# Altium schematic sheet schematic.SchDoc
size A3
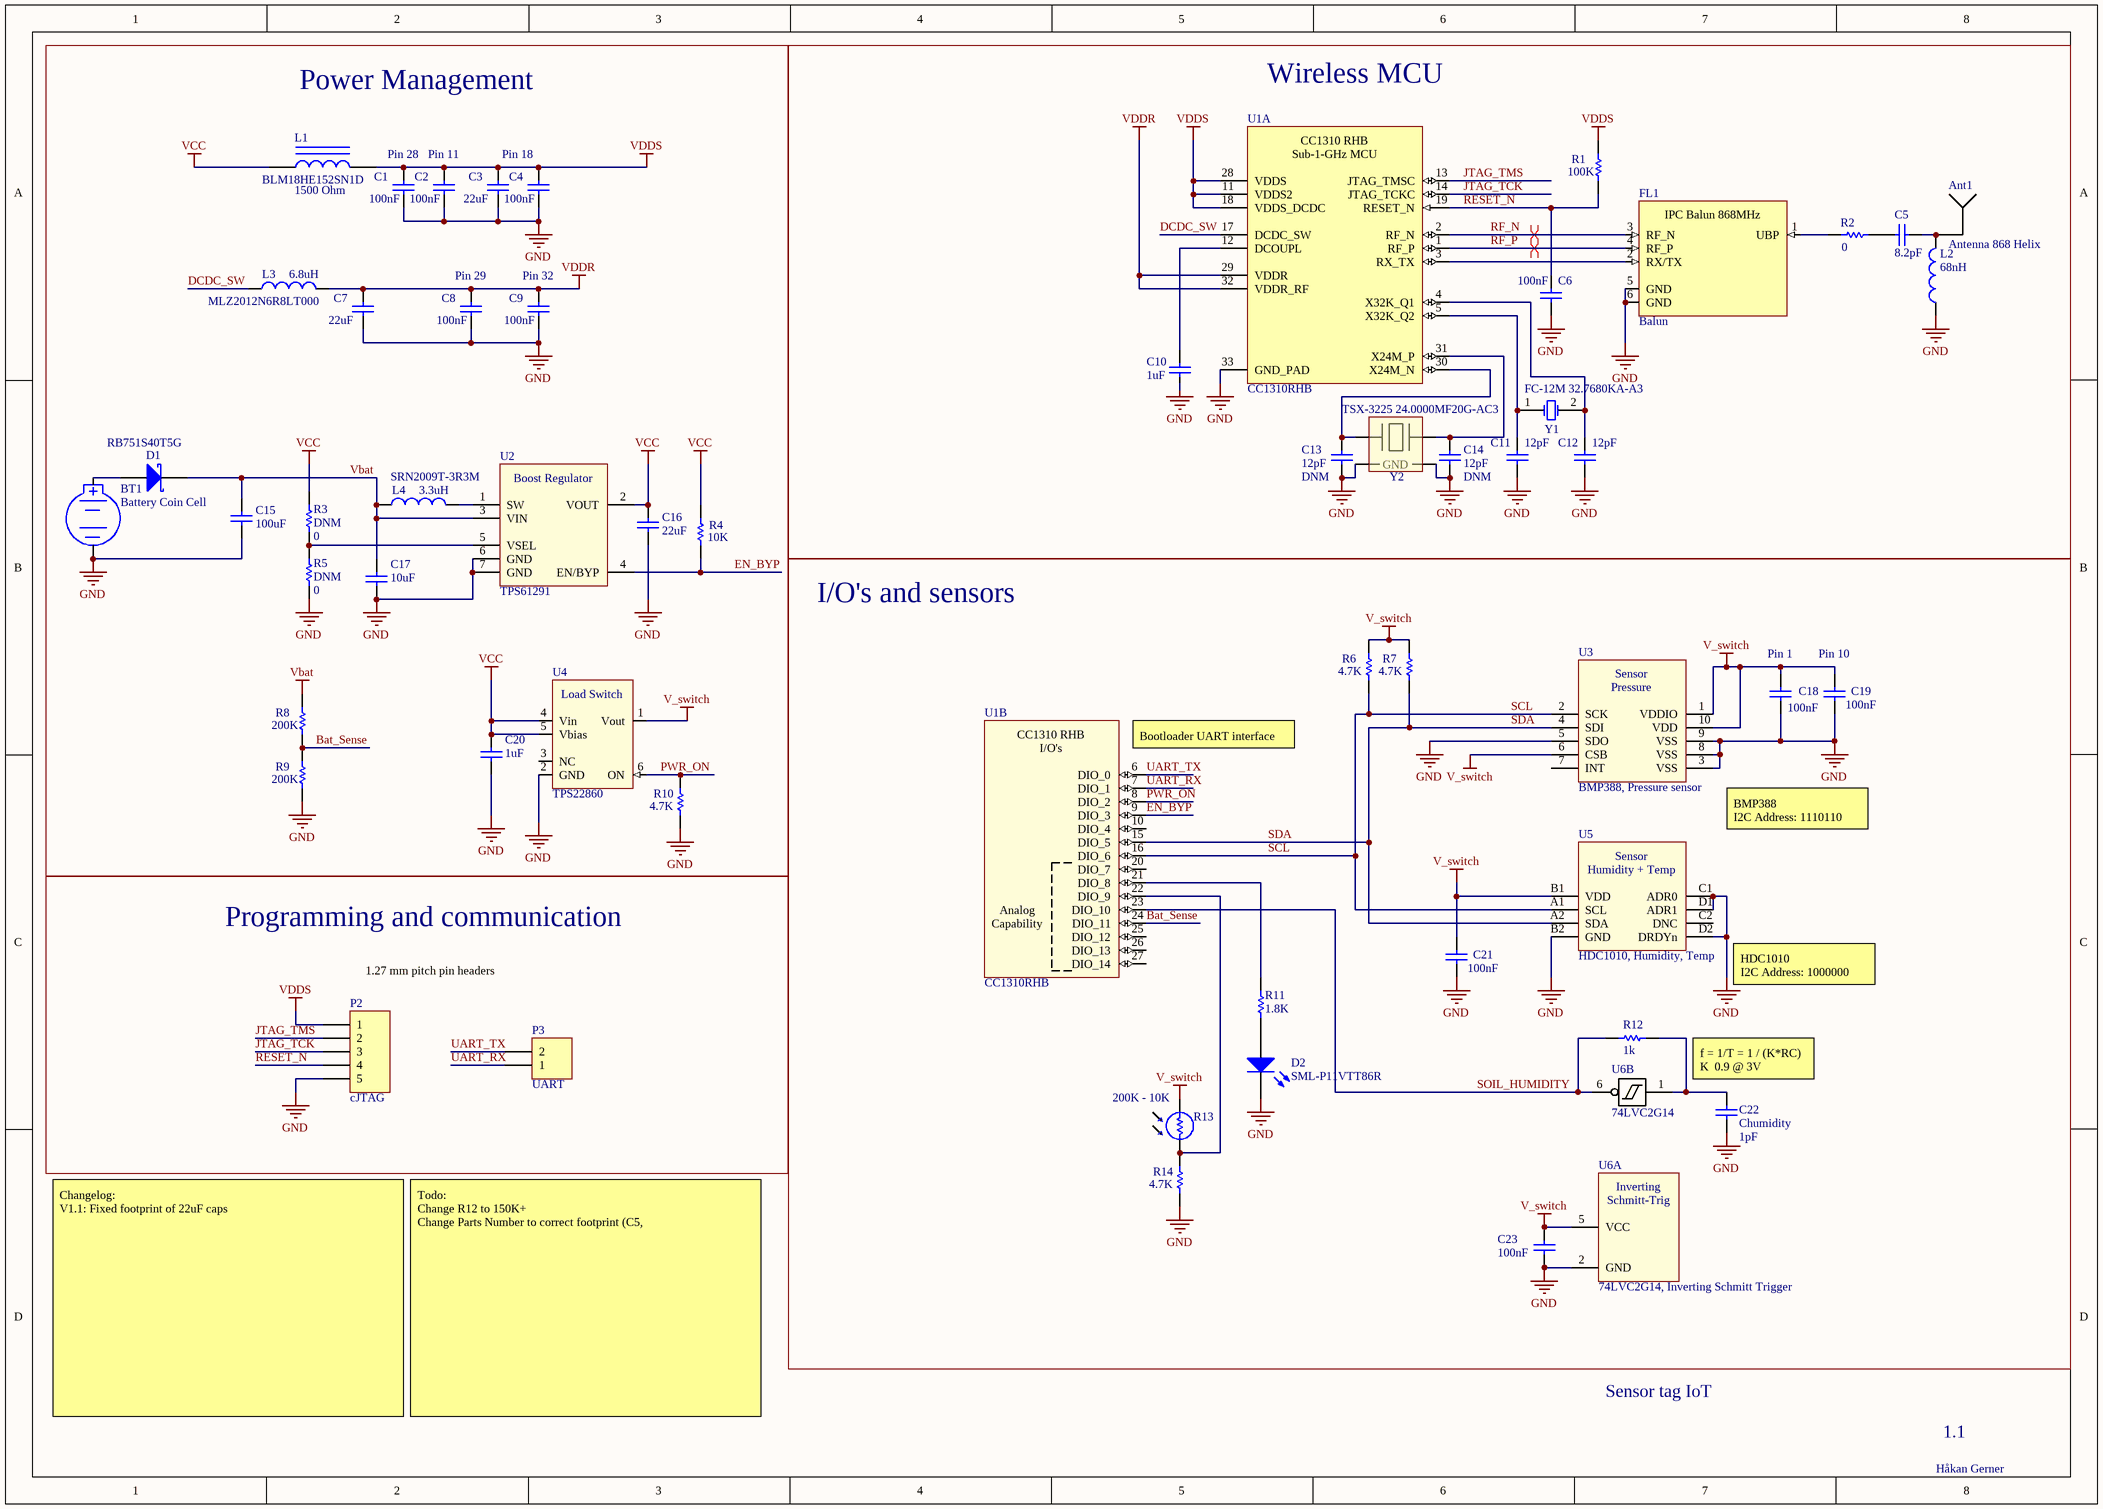
[diagram p0: schematic.SchDoc]

## Parts
Ant1  Antenna 868 Helix  [Antenna_868_Helix]  (net tie, no BOM)
BT1  Battery Coin Cell  [S8421-45R]
C1  value 100nF  [0402 (CAP)]  (hidden comment: Cap)
C2  value 100nF  [0402 (CAP)]  (hidden comment: Cap)
C3  value 22uF  [0603 (CAP)]  (hidden comment: Cap)
C4  value 100nF  [0402 (CAP)]  (hidden comment: Cap)
C5  value 8.2pF  [0402 (CAP)]  (hidden comment: Cap)
C6  value 100nF  [0402 (CAP)]  (hidden comment: Cap)
C7  value 22uF  [0603 (CAP)]  (hidden comment: Cap)
C8  value 100nF  [0402 (CAP)]  (hidden comment: Cap)
C9  value 100nF  [0402 (CAP)]  (hidden comment: Cap)
C10  value 1uF  [0603 (CAP)]  (hidden comment: Cap)
C11  value 12pF  [0402 (CAP)]  (hidden comment: Cap)
C12  value 12pF  [0402 (CAP)]  (hidden comment: Cap)
C13  DNM  value 12pF  [0402 (CAP)]
C14  DNM  value 12pF  [0402 (CAP)]
C15  value 100uF  [1210 (CAP)]  (hidden comment: GRM32EC70J107ME15L)
C16  value 22uF  [0805 (CAP)]  (hidden comment: Cap)
C17  value 10uF  [0805 (CAP)]  (hidden comment: Cap)
C18  value 100nF  [0402 (CAP)]  (hidden comment: Cap)
C19  value 100nF  [0402 (CAP)]  (hidden comment: Cap)
C20  value 1uF  [0603 (CAP)]  (hidden comment: Cap)
C21  value 100nF  [0402 (CAP)]  (hidden comment: Cap)
C22  Chumidity  value 1pF  [Soil_Cap]  (net tie, no BOM)
C23  value 100nF  [0402 (CAP)]  (hidden comment: Cap)
D1  RB751S40T5G  [SOD-523]
D2  SML-P11VTT86R  [0402 (RES)]
FL1  Balun  [0850BM14E0016]
L1  BLM18HE152SN1D  value 1500 Ohm  [0603 (IND)]
L2  value 68nH  [0603 (IND)]  (hidden comment: Inductor)
L3  MLZ2012N6R8LT000  value 6.8uH  [0805 (IND)]
L4  value 3.3uH  Part Number: SRN2009T-3R3M  [SRN2009T]  (hidden comment: Inductor)
P2  cJTAG  [5pin-1.27]  (no BOM)
P3  UART  [2pin-1.27]  (no BOM)
R1  value 100K  [0402 (RES)]  (hidden comment: Res1)
R2  value 0  [0402 (RES)]
R3  DNM  value 0  [0402 (RES)]
R4  value 10K  [0402 (RES)]  (hidden comment: Res1)
R5  DNM  value 0  [0402 (RES)]
R6  value 4.7K  [0402 (RES)]  (hidden comment: Res1)
R7  value 4.7K  [0402 (RES)]  (hidden comment: Res1)
R8  value 200K  [0402 (RES)]  (hidden comment: Res1)
R9  value 200K  [0402 (RES)]  (hidden comment: Res1)
R10  value 4.7K  [0402 (RES)]  (hidden comment: Res1)
R11  value 1.8K  [0402 (RES)]  (hidden comment: Res1)
R12  value 1k  [0402 (RES)]  (hidden comment: Rcharge)
R13  200K - 10K  [Photoresistor]  (no BOM)
R14  value 4.7K  [0402 (RES)]  (hidden comment: Res1)
U1  CC1310RHB  [VQFN-32_5x5]  (parts A,B of 2)
U2  TPS61291  [TPS61291]
U3  BMP388, Pressure sensor  [BMP388]
U4  TPS22860  [SOT23-5]
U5  HDC1010, Humidity, Temp  [HDC1010]
U6  74LVC2G14, Inverting Schmitt Trigger  [74LVC2G14]  (parts A,B of 3)
Y1  FC-12M 32.7680KA-A3  [FC-12M 32.7680KA-A3]
Y2  TSX-3225 24.0000MF20G-AC3  [TSX-3225 24.0000MF20G-AC3]

## Blocks framed on the sheet
Power Management: BT1 C1-C4 C7-C9 C15-C17 C20 D1 L1 L3 L4 R3-R5 R8-R10 U2 U4
Wireless MCU: Ant1 C5 C6 C10-C14 FL1 L2 R1 R2 U1 Y1 Y2
I/O's and sensors: C18 C19 C21-C23 D2 R6 R7 R11-R14 U1 U3 U5 U6
Programming and communication: P2 P3

## Nets
GND: BT1.2(Negative) C1.1 C2.1 C3.1 C4.1 C6.2 C7.1 C8.1 C9.1 C10.1 C11.1 C12.1 C13.1 C14.1 C15.1 C16.1 C17.1 C18.1 C19.1 C20.1 C21.1 C22.2 C23.1 D2.2(K) FL1.5(GND) FL1.6(GND) L2.2 P2.5 R5.2 R9.1 R10.1 R14.1 U1.33(GND_PAD) U2.6(GND) U2.7(GND) U3.3(VSS) U3.5(SDO) U3.8(VSS) U3.9(VSS) U4.2(GND) U5.B2(GND) U5.C1(ADR0) U5.D1(ADR1) U5.D2(DRDYn) U6.2(GND) Y2.2(ON) Y2.4(ON)
V_switch: C18.2 C19.2 C21.2 C23.2 R6.2 R7.2 R13.1 U3.1(VDDIO) U3.6(CSB) U3.10(VDD) U4.1(Vout) U5.B1(VDD) U6.5(VCC)
Vbat: C15.2 C17.2 D1.2(K) L4.1 R8.2 U2.3(VIN)
VCC: C16.2 C20.2 L1.1 R3.1 R4.1 U2.2(VOUT) U4.4(Vin) U4.5(Vbias)
VDDR: C7.2 C8.2 C9.2 L3.2 U1.29(VDDR) U1.32(VDDR_RF)
VDDS: C1.2 C2.2 C3.2 C4.2 L1.2 P2.1 R1.2 U1.11(VDDS2) U1.18(VDDS_DCDC) U1.28(VDDS)
Bat_Sense: R8.1 R9.2 U1.24(DIO_11)
DCDC_SW: L3.1 U1.17(DCDC_SW)
EN_BYP: R4.2 U1.9(DIO_3) U2.4(EN/BYP)
JTAG_TCK: P2.3 U1.14(JTAG_TCKC)
JTAG_TMS: P2.2 U1.13(JTAG_TMSC)
PWR_ON: R10.2 U1.8(DIO_2) U4.6(ON)
RESET_N: C6.1 P2.4 R1.1 U1.19(RESET_N)
RF_N: FL1.3(RF_N) U1.2(RF_N)
RF_P: FL1.4(RF_P) U1.1(RF_P)
SCL: R6.1 U1.16(DIO_6) U3.2(SCK) U5.A1(SCL)
SDA: R7.1 U1.15(DIO_5) U3.4(SDI) U5.A2(SDA)
SOIL_HUMIDITY: R12.2 U1.23(DIO_10) U6.6(1Y)
UART_RX: P3.1 U1.7(DIO_1)
UART_TX: P3.2 U1.6(DIO_0)
NetAnt1_1: Ant1.1 C5.2 L2.1
NetBT1_1: BT1.1(Positive) D1.1(A)
NetC5_1: C5.1 R2.2
NetC10_2: C10.2 U1.12(DCOUPL)
NetC11_2: C11.2 U1.5(X32K_Q2) Y1.1(OSC1)
NetC12_2: C12.2 U1.4(X32K_Q1) Y1.2(OSC2)
NetC13_2: C13.2 U1.30(X24M_N) Y2.1(ON)
NetC14_2: C14.2 U1.31(X24M_P) Y2.3(ON)
NetC22_1: C22.1 R12.1 U6.1(1A)
NetD2_1: D2.1(A) R11.2
NetFL1_1: FL1.1(UBP) R2.1
NetFL1_2: FL1.2(RX/TX) U1.3(RX_TX)
NetL4_2: L4.2 U2.1(SW)
NetR3_2: R3.2 R5.1 U2.5(VSEL)
NetR11_1: R11.1 U1.21(DIO_8)
NetR13_2: R13.2 R14.2 U1.22(DIO_9)

Not connected (* = marked no-connect by the designer): U1 10(DIO_4) 20(DIO_7) 25(DIO_12) 26(DIO_13) 27(DIO_14); U3 7(INT); U4 3(NC); U5 C2(DNC)

## Layout directives
differential pair: RF_N, RF_P

## Notes on the sheet
- Pin 28
- Pin 11
- Pin 18
- (near C8) Pin 29
- (near C9) Pin 32
- (near C18) Pin 1
- (near C19) Pin 10
- (near U1) Bootloader UART interface
- (near U3) BMP388
  I2C Address: 1110110
- (near P2) 1.27 mm pitch pin headers
- (near U5) HDC1010
  I2C Address: 1000000
- (near C22) f = 1/T = 1 / (K*RC)
  K  0.9 @ 3V
- Sensor tag IoT
- Changelog:
  V1.1: Fixed footprint of 22uF caps
- Todo:
  Change R12 to 150K+
  Change Parts Number to correct footprint (C5,
- 1.1
- Håkan Gerner
- (in symbol 74LVC2G14, part A) Inverting; Schmitt-Trig
- (in symbol 0850BM14E0016) IPC Balun 868MHz
- (in symbol BMP388) Sensor; Pressure
- (in symbol CC1310RHB, part A) CC1310 RHB; Sub-1-GHz MCU
- (in symbol CC1310RHB, part B) CC1310 RHB; I/O's; Analog; Capability
- (in symbol Crystal) GND
- (in symbol HDC1010) Sensor; Humidity + Temp
- (in symbol TPS22860) Load Switch
- (in symbol TPS61291) Boost Regulator

## Library data of the parts
C1 C2 C4 C6 C8 C9 C15 C18 C19 C21 C23 = Cap: Capacitor; Part Number: GCM155R71C104KA55J; Published: 8-Jun-2000; LatestRevisionDate: 17-Jul-2002; LatestRevisionNote: Re-released for DXP Platform.; PackageReference: RAD-0.3; Publisher: Altium Limited; PackageDescription: Radial Cap, Thru-Hole; 2 Leads; 0.3 in Pin Spacing
C3 C7 = Cap: Capacitor; Part Number: GRM188R61A226ME15D; Published: 8-Jun-2000; LatestRevisionDate: 17-Jul-2002; LatestRevisionNote: Re-released for DXP Platform.; PackageReference: RAD-0.3; Publisher: Altium Limited; PackageDescription: Radial Cap, Thru-Hole; 2 Leads; 0.3 in Pin Spacing
C5 = Cap: Capacitor; Part Number: 250R05L8R2CV4T; Published: 8-Jun-2000; LatestRevisionDate: 17-Jul-2002; LatestRevisionNote: Re-released for DXP Platform.; PackageReference: RAD-0.3; Publisher: Altium Limited; PackageDescription: Radial Cap, Thru-Hole; 2 Leads; 0.3 in Pin Spacing
C10 C20 = Cap: Capacitor; Part Number: GCM188R71E105KA64D; Published: 8-Jun-2000; LatestRevisionDate: 17-Jul-2002; LatestRevisionNote: Re-released for DXP Platform.; PackageReference: RAD-0.3; Publisher: Altium Limited; PackageDescription: Radial Cap, Thru-Hole; 2 Leads; 0.3 in Pin Spacing
C11-C14 = Cap: Capacitor; Part Number: GCM1555C1H120JA16D; Published: 8-Jun-2000; LatestRevisionDate: 17-Jul-2002; LatestRevisionNote: Re-released for DXP Platform.; PackageReference: RAD-0.3; Publisher: Altium Limited; PackageDescription: Radial Cap, Thru-Hole; 2 Leads; 0.3 in Pin Spacing
C16 = Cap: Capacitor; Part Number: GRM21BD71A226ME44L; Published: 8-Jun-2000; LatestRevisionDate: 17-Jul-2002; LatestRevisionNote: Re-released for DXP Platform.; PackageReference: RAD-0.3; Publisher: Altium Limited; PackageDescription: Radial Cap, Thru-Hole; 2 Leads; 0.3 in Pin Spacing
C17 = Cap: Capacitor; Part Number: GRM21BC71C106KE11L; Published: 8-Jun-2000; LatestRevisionDate: 17-Jul-2002; LatestRevisionNote: Re-released for DXP Platform.; PackageReference: RAD-0.3; Publisher: Altium Limited; PackageDescription: Radial Cap, Thru-Hole; 2 Leads; 0.3 in Pin Spacing
C22 = Cap: Capacitor; Published: 8-Jun-2000; LatestRevisionDate: 17-Jul-2002; LatestRevisionNote: Re-released for DXP Platform.; PackageReference: RAD-0.3; Publisher: Altium Limited; PackageDescription: Radial Cap, Thru-Hole; 2 Leads; 0.3 in Pin Spacing; Part Number: N/A
D1 = D Schottky: Schottky Diode; Published: 8-Jun-2000; LatestRevisionDate: 17-Jul-2002; LatestRevisionNote: Re-released for DXP Platform.; PackageReference: SMB; Publisher: Altium Limited; PackageDescription: DO-214-AA/SMB; 2 C-Bend Leads; Body 5.3 x 3.6 mm, inc. leads (LxW); Code_JEDEC: DO-214-AA; Part Number: RB751S40T5G
D2 = LED2: Typical RED, GREEN, YELLOW, AMBER GaAs LED; Published: 8-Jun-2000; LatestRevisionDate: 17-Jul-2002; LatestRevisionNote: Re-released for DXP Platform.; PackageVersion: Feb-2002; PackageReference: 3.2X1.6X1.1; Publisher: Altium Limited; PackageDescription: SM LED; 2 Flat Leads; Part Number: SML-P11VTT86R
FL1 = 0850BM14E0016: Part Number: 0850BM14E0016T
L1 = Inductor Iron: Magnetic-Core Inductor; Published: 24-Mar-1999; LatestRevisionDate: 17-Jul-2002; LatestRevisionNote: Re-released for DXP Platform.; PackageReference: AXIAL-0.9; Publisher: Altium Limited; PackageDescription: Axial Device, Thru-Hole; 2 Leads; 0.9 in Pin Spacing; Part Number: BLM18HE152SN1D
L2 = Inductor: Part Number: PE-0603CD680GTT; Code_IEC: 1005; Published: 8-Jun-2000; LatestRevisionDate: 29-May-2009; LatestRevisionNote: IPC-7351 Footprint Added.; PackageReference: 0603; Publisher: Altium Limited; PackageDescription: Chip Inductor; Code_JEITA: 0603
L3 L4 = Inductor: Code_IEC: 1005; Published: 8-Jun-2000; LatestRevisionDate: 29-May-2009; LatestRevisionNote: IPC-7351 Footprint Added.; PackageReference: 0402-A; Publisher: Altium Limited; PackageDescription: Chip Inductor; Code_JEITA: 0402
  L3: Part Number: MLZ2012N6R8LT000
P2 = Header 5: Header, 5-Pin; LatestRevisionDate: 17-Jul-2002; LatestRevisionNote: Re-released for DXP Platform.; Publisher: Altium Limited
P3 = Header 2: Header, 2-Pin; LatestRevisionDate: 17-Jul-2002; LatestRevisionNote: Re-released for DXP Platform.; Publisher: Altium Limited
R1 = Res1: Resistor; Part Number: CRCW0402100KFKED; Published: 8-Jun-2000; LatestRevisionDate: 17-Jul-2002; LatestRevisionNote: Re-released for DXP Platform.; PackageReference: AXIAL-0.3; Publisher: Altium Limited; PackageDescription: Axial Device, Thru-Hole; 2 Leads; 0.3 in Pin Spacing
R2 R3 R5 = Res1: Resistor; Part Number: ERJ-2GE0R00X; Published: 8-Jun-2000; LatestRevisionDate: 17-Jul-2002; LatestRevisionNote: Re-released for DXP Platform.; PackageReference: AXIAL-0.3; Publisher: Altium Limited; PackageDescription: Axial Device, Thru-Hole; 2 Leads; 0.3 in Pin Spacing
R4 = Res1: Resistor; Part Number: CRCW040210K0JNEDC; Published: 8-Jun-2000; LatestRevisionDate: 17-Jul-2002; LatestRevisionNote: Re-released for DXP Platform.; PackageReference: AXIAL-0.3; Publisher: Altium Limited; PackageDescription: Axial Device, Thru-Hole; 2 Leads; 0.3 in Pin Spacing
R6 R7 R10 R14 = Res1: Resistor; Part Number: CRCW04024K70FKEDC; Published: 8-Jun-2000; LatestRevisionDate: 17-Jul-2002; LatestRevisionNote: Re-released for DXP Platform.; PackageReference: AXIAL-0.3; Publisher: Altium Limited; PackageDescription: Axial Device, Thru-Hole; 2 Leads; 0.3 in Pin Spacing
R8 R9 = Res1: Resistor; Part Number: CRG0402F4K7; Published: 8-Jun-2000; LatestRevisionDate: 17-Jul-2002; LatestRevisionNote: Re-released for DXP Platform.; PackageReference: AXIAL-0.3; Publisher: Altium Limited; PackageDescription: Axial Device, Thru-Hole; 2 Leads; 0.3 in Pin Spacing
R11 = Res1: Resistor; Part Number: ERJ-2RKF1801X; Published: 8-Jun-2000; LatestRevisionDate: 17-Jul-2002; LatestRevisionNote: Re-released for DXP Platform.; PackageReference: AXIAL-0.3; Publisher: Altium Limited; PackageDescription: Axial Device, Thru-Hole; 2 Leads; 0.3 in Pin Spacing
R12 = Res1: Resistor; Part Number: RMCF0402ZT0R00CT-ND; Published: 8-Jun-2000; LatestRevisionDate: 17-Jul-2002; LatestRevisionNote: Re-released for DXP Platform.; PackageReference: AXIAL-0.3; Publisher: Altium Limited; PackageDescription: Axial Device, Thru-Hole; 2 Leads; 0.3 in Pin Spacing
R13 = Photo Resistor
U1 = CC1310RHB: Part Number: CC1310F128RHBT
U2 = TPS61291: Part Number: TPS61291DRVR
U3 = BMP388: Part Number: BMP388
U4 = TPS22860: Part Number: TPS22860DBVR
U5 = HDC1010: Part Number: HDC1010YPAR
U6 = 74LVC2G14: Part Number: 74LVC2G14GV,125
Y1 = XTAL: Crystal Oscillator; Published: 8-Jun-2000; LatestRevisionDate: 17-Jul-2002; LatestRevisionNote: Re-released for DXP Platform.; PackageReference: R38; Publisher: Altium Limited; PackageDescription: Crystal, Thru-Hole; 2 Leads; Body 3.1 x 8.2 mm (Dia.xH); Part Number: FC-12M 32.7680KA-A3
Y2 = Crystal: Part Number: TSX-3225 24.0000MF20G-AC3
BT1 = Battery Coin Cell: Part Number: S8421-45R